# EAGLE design blinkedings_ultimate (EAGLE 6.4)
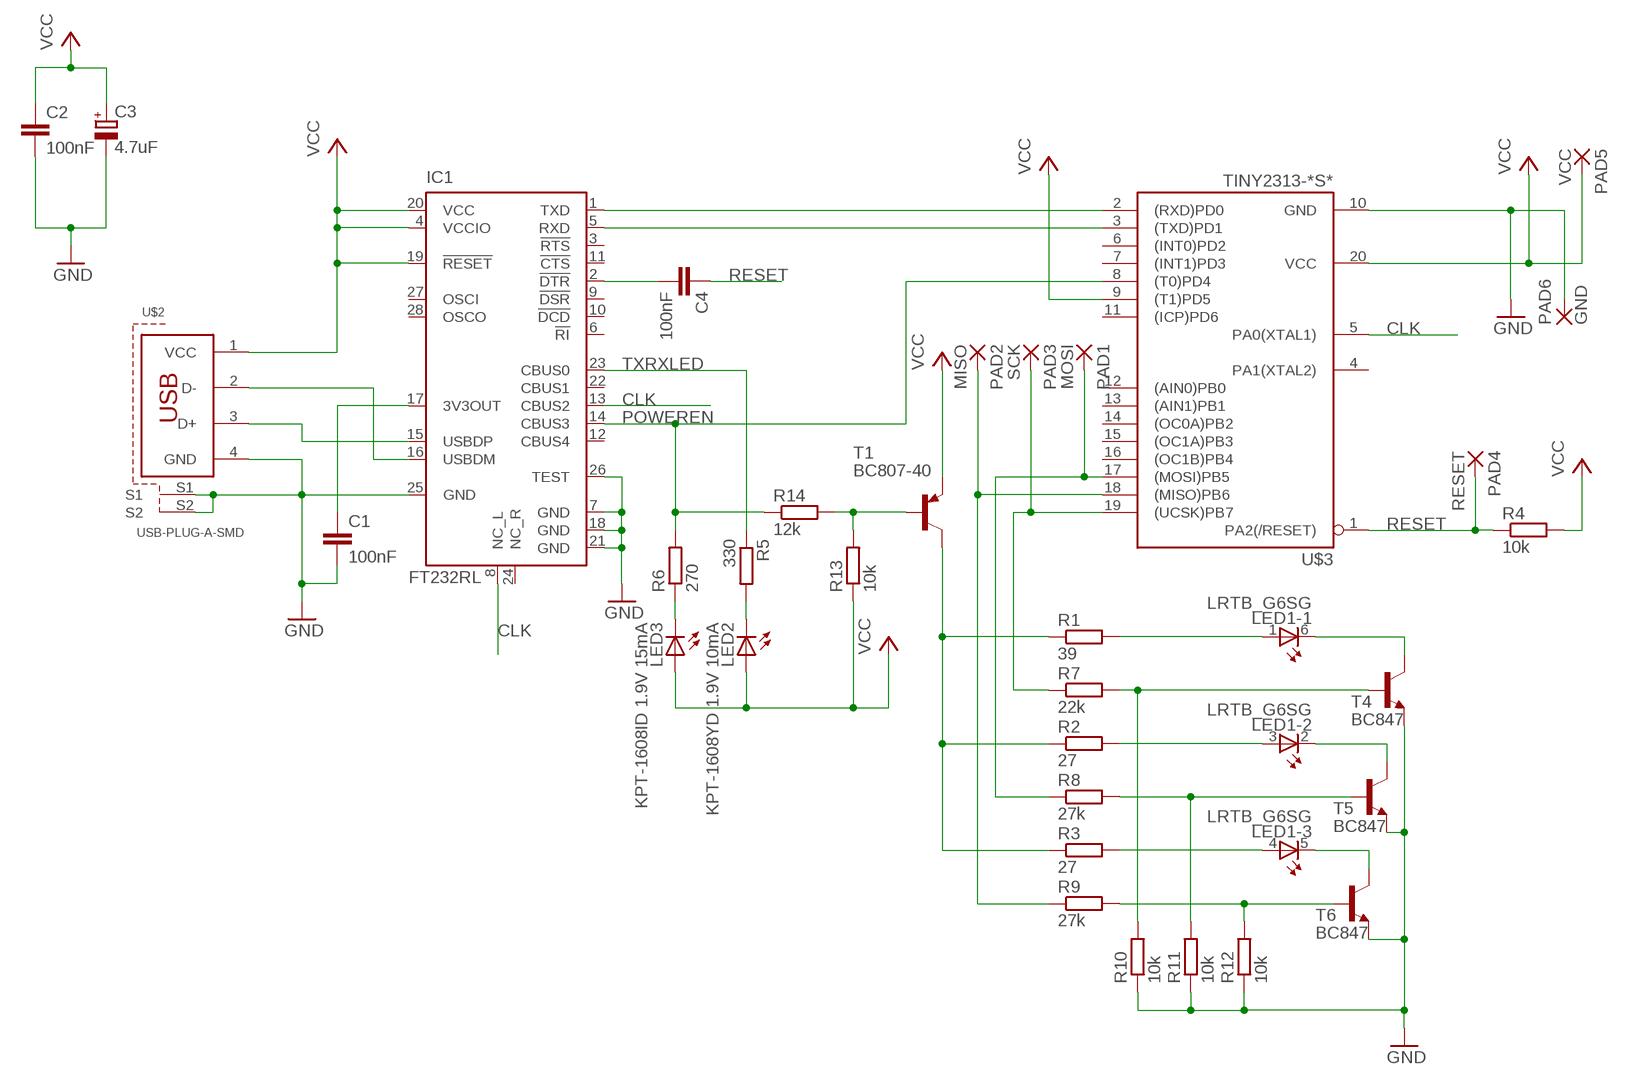
[diagram p0: schematic, sheet 1]

## Parts
C1  100nF  C-EUC0603  [C0603]
C2  100nF  C-EUC0603  [C0603]
C3  4.7uF  CPOL-EUSMCC  [SMC_C]
C4  100nF  C-EUC0603  [C0603]
IC1  FT232RL  [SSOP28]
LED1  LRTB_G6SG  [LRTB_G6SG]
LED2  KPT-1608YD 1.9V 10mA  LEDCHIP-LED0603  [CHIP-LED0603]
LED3  KPT-1608ID 1.9V 15mA  LEDCHIP-LED0603  [CHIP-LED0603]
PAD1  MOSI  SMD2  [SMD1,27-2,54]
PAD2  MISO  SMD2  [SMD1,27-2,54]
PAD3  SCK  SMD2  [SMD1,27-2,54]
PAD4  RESET  SMD2  [SMD1,27-2,54]
PAD5  VCC  SMD2  [SMD1,27-2,54]
PAD6  GND  SMD2  [SMD1,27-2,54]
R1  39  R-EU_R0603  [R0603]
R2  27  R-EU_R0603  [R0603]
R3  27  R-EU_R0603  [R0603]
R4  10k  R-EU_R0603  [R0603]
R5  330  R-EU_R0603  [R0603]
R6  270  R-EU_R0603  [R0603]
R7  22k  R-EU_R0603  [R0603]
R8  27k  R-EU_R0603  [R0603]
R9  27k  R-EU_R0603  [R0603]
R10  10k  R-EU_R0603  [R0603]
R11  10k  R-EU_R0603  [R0603]
R12  10k  R-EU_R0603  [R0603]
R13  10k  R-EU_R0603  [R0603]
R14  12k  R-EU_R0603  [R0603]
T1  BC807-40  BC857C-PNP-SOT23-BEC  [SOT23-BEC]
T4  BC847  [SOT23]
T5  BC847  [SOT23]
T6  BC847  [SOT23]
U$2  USB-PLUG-A-SMD  [USB-A-SMD]
U$3  TINY2313-*S*  [SO20L$]

## Nets
CLK: IC1.8(NC_L) IC1.13(CBUS2) U$3.5(PA0(XTAL1))
DTR: C4.2 IC1.2(!DTR)
GND: C1.2 C2.2 C3.- IC1.7(GND) IC1.18(GND) IC1.21(GND) IC1.25(GND) IC1.26(TEST) PAD6.1(P) R10.1 R11.1 R12.1 T4.2(E) T5.2(E) T6.2(E) U$2.4(GND) U$2.S1 U$2.S2 U$3.10(GND)
N$1: C1.1 IC1.17(3V3OUT)
N$2: IC1.16(USBDM) U$2.2(D-)
N$3: IC1.15(USBDP) U$2.3(D+)
N$4: LED3.C R6.1
N$5: IC1.5(RXD) U$3.3((TXD)PD1)
N$6: IC1.1(TXD) U$3.2((RXD)PD0)
N$7: LED2.C R5.2
N$8: LED1.6(-1:C) T4.3(C)
N$9: LED1.3(-2:A) R2.2
N$10: LED1.4(-3:A) R3.2
N$11: LED1.1(-1:A) R1.2
N$12: R9.2 R12.2 T6.1(B)
N$13: R8.2 R11.2 T5.1(B)
N$15: PAD2.1(P) R9.1 U$3.18((MISO)PB6)
N$16: PAD3.1(P) R7.1 U$3.19((UCSK)PB7)
N$17: R7.2 R10.2 T4.1(B)
N$18: LED1.2(-2:C) T5.3(C)
N$19: R1.1 R2.1 R3.1 T1.C
N$20: LED1.5(-3:C) T6.3(C)
N$21: R13.2 R14.2 T1.B
N$22: PAD1.1(P) R8.1 U$3.17((MOSI)PB5)
POWEREN: IC1.14(CBUS3) R6.2 R14.1 U$3.8((T0)PD4)
RESET: C4.1 PAD4.1(P) R4.1 U$3.1(PA2(/RESET))
TXRXLED: IC1.23(CBUS0) R5.1
VCC: C2.1 C3.+ IC1.4(VCCIO) IC1.19(!RESET) IC1.20(VCC) LED2.A LED3.A PAD5.1(P) R4.2 R13.1 T1.E U$2.1(VCC) U$3.9((T1)PD5) U$3.20(VCC)
Unconnected: IC1.3(!RTS) IC1.6(!RI) IC1.9(!DSR) IC1.10(!DCD) IC1.11(!CTS) IC1.12(CBUS4) IC1.22(CBUS1) IC1.24(NC_R) IC1.27(OSCI) IC1.28(OSCO) U$3.4(PA1(XTAL2)) U$3.6((INT0)PD2) U$3.7((INT1)PD3) U$3.11((ICP)PD6) U$3.12((AIN0)PB0) U$3.13((AIN1)PB1) U$3.14((OC0A)PB2) U$3.15((OC1A)PB3) U$3.16((OC1B)PB4)

## Library data of the parts
C1 C2 C4 = resistor:C-EU: CAPACITOR, European symbol
C3 = resistor:CPOL-EU: POLARIZED CAPACITOR, European symbol
IC1 = ftdichip:FT232R: Source: http://www.ftdichip.com/Documents/DataSheets/DS_FT232R_v104.pdf; MPN: FT232RL; OC_FARNELL: 1146032; OC_NEWARK: 91K9918
LED1 = led:LRTB_G6SG: LRTB G6SG 6-lead TOPLED® Source: OSRAM Opto Semiconductors ... LRTB_G6SG_Pb_free.pdf
LED2 LED3 = led:LED: LED OSRAM: - CHIPLED LG R971, LG N971, LY N971, LG Q971, LY Q971, LO R971, LY R971 LH N974, LH R974 LS Q976, LO Q976, LY Q976 LO Q996 - Hyper CHIPLED LW Q18S LB Q993, LB Q99A, LB R99A - SideLED LS A670, LO A670, LY A670, LG A670, LP A670 LB A673, LV A673, LT A673, LW A673 LH A674 LY A675 LS A676, LA A676, LO A676, LY A676, LW A676 LS A679, LY A679, LG A679 - Hyper Micro SIDELED® LS Y876, LA Y876, LO Y876, LY Y876 LT Y87S - SmartLED LW L88C, LW L88S LB L89C, LB L89S, LG L890 LS L89K, LO L89K, LY L89K LS L896, LA L896, LO L896, LY L896 - TOPLED LS T670, LO T670, LY T670, LG T670, LP T670 LSG T670, LSP T670, LSY T670, LOP T670, LYG T670 LG T671, LOG T671, LSG T671 LB T673, LV T673, LT T673, LW T673 LH T674 LS T676, LA T676, LO T676, LY T676, LB T676, LH T676, LSB T676, LW T676 LB T67C, LV T67C, LT T67C, LS T67K, LO T67K, LY T67K, LW E67C LS E67B, LA E67B, LO E67B, LY E67B, LB E67C, LV E67C, LT E67C LW T67C LS T679, LY T679, LG T679 LS T770, LO T770, LY T770, LG T770, LP T770 LB T773, LV T773, LT T773, LW T773 LH T774 LS E675, LA E675, LY E675, LS T675 LS T776, LA T776, LO T776, LY T776, LB T776 LHGB T686 LT T68C, LB T68C - Hyper Mini TOPLED® LB M676 - Mini TOPLED Santana® LG M470 LS M47K, LO M47K, LY M47K Source: http://www.osram.convergy.de LUXEON: - LUMILED® LXK2-PW12-R00, LXK2-PW12-S00, LXK2-PW14-U00, LXK2-PW14-V00 LXK2-PM12-R00, LXK2-PM12-S00, LXK2-PM14-U00 LXK2-PE12-Q00, LXK2-PE12-R00, LXK2-PE12-S00, LXK2-PE14-T00, LXK2-PE14-U00 LXK2-PB12-K00, LXK2-PB12-L00, LXK2-PB12-M00, LXK2-PB14-N00, LXK2-PB14-P00, LXK2-PB14-Q00 LXK2-PR12-L00, LXK2-PR12-M00, LXK2-PR14-Q00, LXK2-PR14-R00 LXK2-PD12-Q00, LXK2-PD12-R00, LXK2-PD12-S00 LXK2-PH12-R00, LXK2-PH12-S00 LXK2-PL12-P00, LXK2-PL12-Q00, LXK2-PL12-R00 Source: www.luxeon.com KINGBRIGHT: KA-3528ASYC Source: www.kingbright.com
PAD1-PAD6 = wirepad:SMD2: SMD PAD
R1-R14 = resistor:R-EU_: RESISTOR, European symbol
T1 = transistor:*-PNP-: PNP Transistror
T4-T6 = transistor:BC847: NPN TRANSISTOR
U$2 = usb:USB-PLUG
U$3 = avr-6:TINY2313*: Atmel Tiny2313 2K Flash, 128 bytes EEPROM, 128 bytes RAM

## Board
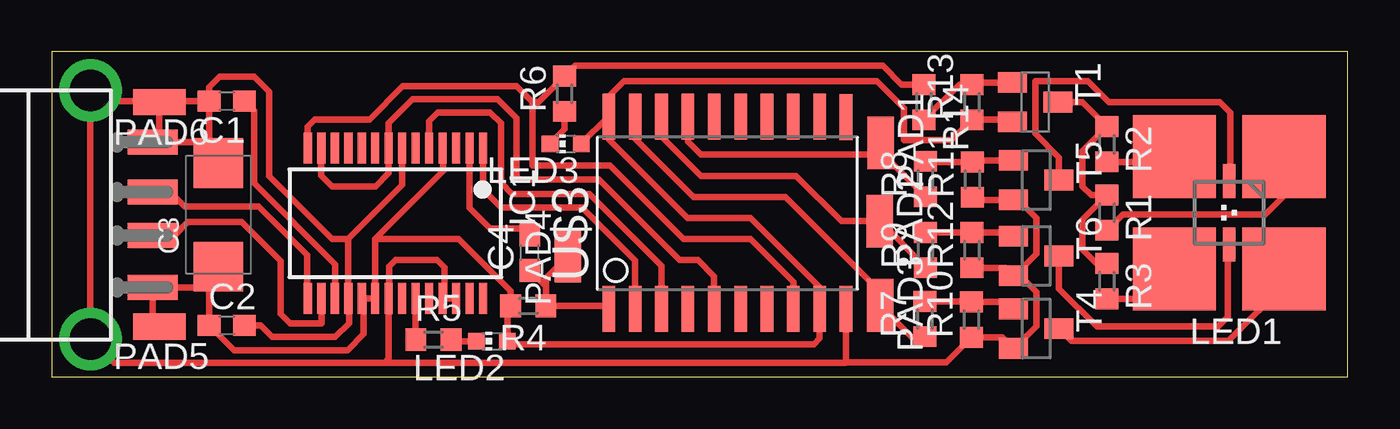
[diagram p1: board, top side]

Size 62.46 x 15.69 mm. Coordinates in mm from the lower left corner, seen from the top.
Outline: 0,0 62.46,0 62.46,15.69 0,15.69 0,0
Copper layers (1*16): Top 0.035mm / dielectric 1.5mm / Bottom 0.035mm
Design rules "smd": minimum track width 12mil, minimum drill 30mil, track to track 12mil, track to pad 9mil, pad to pad 8mil, via to via 12mil, smd to smd 8mil, copper to edge 12mil, drill to drill 12mil, minimum pad ring 10mil, minimum via ring 10mil, stop-mask expansion 4mil, vias tented up to drill 0mil, thermal gap 12mil

### Footprints (pad centres in the part's own frame; a part is rotated, then mirrored left to right if it is on the bottom)
C0603 = smd 1.1 x 1: 1 -0.85,0; 2 0.85,0
SMC_C = smd 2.4 x 2.4: + -2.5,0; - 2.5,0
SSOP28 = smd 0.4 x 1.5: 1 -4.225,-3.625; 2 -3.575,-3.625; 3 -2.925,-3.625; 4 -2.275,-3.625; 5 -1.625,-3.625; 6 -0.975,-3.625; 7 -0.325,-3.625; 8 0.325,-3.625; 9 0.975,-3.625; 10 1.625,-3.625; 11 2.275,-3.625; 12 2.925,-3.625; 13 3.575,-3.625; 14 4.225,-3.625; 15 4.225,3.625; 16 3.575,3.625; 17 2.925,3.625; 18 2.275,3.625; 19 1.625,3.625; 20 0.975,3.625; 21 0.325,3.625; 22 -0.325,3.625; 23 -0.975,3.625; 24 -1.625,3.625; 25 -2.275,3.625; 26 -2.925,3.625; 27 -3.575,3.625; 28 -4.225,3.625
LRTB_G6SG = smd 4 x 4: 1 -2.65,-2.7; 3 2.65,-2.7; 4 2.65,2.7; 6 -2.65,2.7 | smd 0.6 x 1.65: 2 0,-1.525; 5 0,1.525
CHIP-LED0603 = smd 0.8 x 0.8: A 0,-0.75; C 0,0.75
SMD1,27-2,54 = smd 1.27 x 2.54: 1 0,0
R0603 = smd 1 x 1.1: 1 -0.85,0; 2 0.85,0
SOT23-BEC = smd 1 x 1.4: B -0.95,-1.1; C 0,1.1; E 0.95,-1.1
SOT23 = smd 1 x 1.4: 1 -0.95,-1.1; 2 0.95,-1.1; 3 0,1.1
USB-A-SMD = smd 2.4 x 1.2: 1 10.9,-3.6; 2 10.9,-1.1; 3 10.9,1; 4 10.9,3.4 | drill 2: S1 7.9,5.9; S2 7.9,-6.1
SO20L$ = smd 0.61 x 2.21: 1 -5.715,-4.636; 2 -4.445,-4.636; 3 -3.175,-4.636; 4 -1.905,-4.636; 5 -0.635,-4.636; 6 0.635,-4.636; 7 1.905,-4.636; 8 3.175,-4.636; 9 4.445,-4.636; 10 5.715,-4.636; 11 5.715,4.61; 12 4.445,4.636; 13 3.175,4.636; 14 1.905,4.636; 15 0.635,4.636; 16 -0.635,4.636; 17 -1.905,4.636; 18 -3.175,4.636; 19 -4.445,4.636; 20 -5.715,4.636

### Placement (x,y rotation side)
C1  8.43,13.31 180 top
C2  8.43,2.49 0 top
C3  8.03,7.82 90 top
C4  23.04,5.99 90 top
IC1  16.56,7.42 180 top
LED1  56.74,7.92 180 top
LED2  21.21,1.73 90 top
LED3  24.77,11.25 90 top
PAD1  39.95,11.3 180 top
PAD2  39.9,7.52 180 top
PAD3  39.93,3.45 180 top
PAD4  24.87,5.84 0 top
PAD5  5.18,2.44 90 top
PAD6  5.18,13.26 90 top
R1  50.85,7.92 270 top
R2  50.85,11.23 270 top
R3  50.85,4.62 270 top
R4  22.96,3.43 180 top
R5  18.39,1.8 0 top
R6  24.71,13.67 90 top
R7  42.09,2.79 90 top
R8  42.11,9.55 90 top
R9  42.11,6.12 90 top
R10  44.32,2.77 90 top
R11  44.37,9.53 90 top
R12  44.35,6.12 90 top
R13  44.35,13.26 90 top
R14  42.04,13.26 270 top
T1  47.4,13.26 270 top
T4  47.45,2.34 270 top
T5  47.45,9.5 270 top
T6  47.45,5.84 270 top
U$2  -6.05,7.92 0 top
U$3  32.56,7.92 0 top

### Tracks (layer width: path | path; a pad name or v marks a point on that pad's centre or on a via)
CLK
  Top 0.305: IC1.13 12.99,9.72 13.51,9.19 15.6,9.19 16.23,9.83 IC1.8 | IC1.8 | IC1.8 16.23,12.24 17.4,13.41 21.49,13.41 22.4,12.5 22.4,9.68 22.55,9.52 26.36,9.52 30.25,5.64 31.14,5.64 31.93,4.85 U$3.5
DTR
  Top 0.305: IC1.2 20.14,8.16 21.13,7.16 22.72,7.16 C4.2
GND
  Top 0.305: IC1.26 IC1.25 18.92,3.88 18.92,5.28 18.57,5.64 16.56,5.64 16.26,5.33 16.26,3.77 | 16.26,3.81 IC1.21 | 16.26,3.05 16.26,3.77 | 16.26,3.77 IC1.21 | 5.45,11.32 U$2.4 | U$2.4 7.02,11.32 C3.- 7.58,10.77 C1.2 | IC1.7 16.89,9.27 14.27,6.65 | 16.05,0.69 38.25,0.69 38.28,0.71 | 16.05,0.69 2.99,0.69 U$2.S2 U$2.S1 2.37,13.31 C1.2 | PAD6.1 5.18,11.65 U$2.4 | C1.2 7.58,13.98 8.08,14.48 9.75,14.48 10.46,13.77 10.46,9.7 13.51,6.65 14.27,6.65 | C2.2 10.06,2.49 10.62,1.93 13.66,1.93 14.33,2.59 14.33,3.75 IC1.18 14.27,6.65 | IC1.21 16.24,0.87 16.05,0.69 | U$3.10 38.28,0.71 | T6.2 46.67,4.89 47.45,4.11 47.45,2.44 46.4,1.39 T4.2 45.82,1.92 R10.1 43.12,0.71 38.28,0.71 | R11.1 44.5,8.55 T5.2 46.57,8.55 47.45,7.67 47.45,5.94 46.4,4.89 T6.2 | R12.1 45.97,5.27 T6.2
N$1
  Top 0.305: C1.1 9.74,12.85 9.74,9.36 13.66,5.44 13.66,3.82 IC1.17
N$2
  Top 0.305: U$2.2 5.91,6.82 6.55,7.47 9.14,7.47 11.02,5.59 11.02,3.05 11.48,2.59 13,2.59 13,3.77 IC1.16
N$3
  Top 0.305: U$2.3 5.71,8.92 6.4,8.23 9.96,8.23 12.29,5.89 12.29,3.83 IC1.15
N$4
  Top 0.305: R6.1 24.71,11.95 LED3.C
N$5
  Top 0.305: U$3.3 29.39,5.36 25.91,8.84 22.17,8.84 21.64,9.37 21.64,12.24 21.13,12.75 18.59,12.75 18.19,12.34 IC1.5
N$6
  Top 0.305: U$3.2 28.12,5.61 25.55,8.18 21.64,8.18 20.79,9.03 IC1.1
N$7
  Top 0.305: LED2.C 19.32,1.73 R5.2
N$8
  Top 0.305: T4.3 49.13,1.75 56.72,1.75 59.59,4.62 59.59,5.03 LED1.6
N$9
  Top 0.305: R2.2 53.85,10.38 LED1.3
N$10
  Top 0.305: R3.2 52.64,3.77 LED1.4
N$11
  Top 0.305: R1.2 51.62,7.85 58.5,7.85 59.33,8.69 59.33,10.57 LED1.1
N$12
  Top 0.305: R9.2 R12.2 46.17,6.97 T6.1
N$13
  Top 0.305: T5.1 44.45,10.45 R11.2 42.14,10.37 R8.2
N$15
  Top 0.305: R9.1 42.11,5.31 PAD2.1 38.05,7.52 35.86,9.7 31.29,9.7 29.39,11.61 U$3.18
N$16
  Top 0.305: R7.1 41.44,1.94 PAD3.1 39.93,4.11 35.36,8.69 30.94,8.69 28.12,11.51 U$3.19
N$17
  Top 0.305: R7.2 44.3,3.64 R10.2 46.02,3.62 T4.1
N$18
  Top 0.305: T5.3 48.55,10.58 47.4,11.73 47.4,14.27 49.94,14.27 50.95,13.26 56.29,13.26 56.79,12.75 56.79,9.5 LED1.2
N$19
  Top 0.305: R3.1 50.36,5.47 49.68,6.15 49.68,7.61 R1.1 50.1,8.77 49.68,9.19 49.68,10.91 R2.1 49.67,13.26 T1.C
N$20
  Top 0.305: T6.3 48.55,4.26 50.37,2.44 56.24,2.44 56.69,2.9 56.69,6.35 LED1.5
N$21
  Top 0.305: T1.B 44.45,14.21 R13.2 43.74,14.11 R14.2
N$22
  Top 0.305: R8.1 39.95,10.86 PAD1.1 39.37,10.72 31.29,10.72 30.66,11.35 U$3.17
POWEREN
  Top 0.305: R14.1 40.96,14.11 40.06,15.01 25.21,15.01 R6.2 23.46,13.26 23.16,13.26 | U$3.8 35.74,4.6 33.68,6.65 30.45,6.65 26.9,10.21 23.16,10.21 23.16,13.26 | IC1.14 12.34,12.08 12.67,12.42 15.32,12.42 16.92,14.02 22.4,14.02 23.16,13.26
RESET
  Top 0.305: U$3.1 26.71,3.43 R4.1 23.81,4.37 | 23.81,4.37 C4.1 | 23.81,4.37 23.81,4.79 PAD4.1
TXRXLED
  Top 0.305: IC1.23 R5.1
VCC
  Top 0.305: U$2.1 7.03,4.32 C3.+ 7.58,4.88 C2.1 8.78,1.3 14.25,1.3 15.04,2.08 15.04,3.69 IC1.19 IC1.20 15.59,6.67 | U$2.1 5.18,4 | 15.59,6.67 18.85,9.93 18.85,11.03 IC1.4 | PAD5.1 4.85,2.76 U$2.1 | 15.59,6.67 15.6,6.65 19.61,6.65 22.11,4.15 R4.2 21.96,3.28 LED2.A 22.11,1.57 36.73,1.57 37.01,1.85 U$3.9 37.01,4.34 33.68,7.67 30.63,7.67 26.85,11.46 U$3.20 | T1.E 46.2,12.41 R13.1 43.37,11.43 41.07,11.43 41.07,12.98 39.78,14.27 27.58,14.27 26.85,13.54 U$3.20 | U$3.20 26.82,12.56 LED3.A

### Text on the board
Document: Yomin@Netz39 | Blinkedings Ultimate